# EAGLE schematic V0_24 (EAGLE 8.5.2)
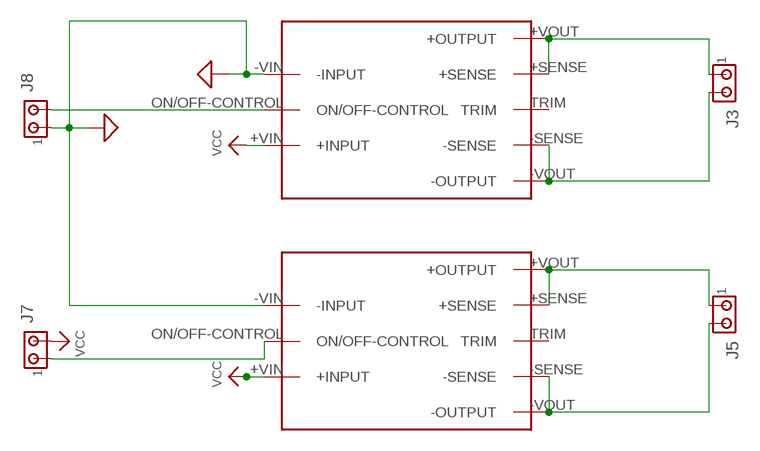
[diagram p0: schematic, sheet 1]

## Parts
J3  MTA02-156  [MYJUMPER]
J5  MTA02-156  [MYJUMPER]
J7  MTA02-156  [MYJUMPER]
J8  MTA02-156  [MYJUMPER]
U$3  DC/DC_CONV_24V  [UWE]
U$4  DC/DC_CONV_24V  [UWE]

## Nets
GND: J8.1 U$3.-VIN(-INPUT) U$4.-VIN(-INPUT) ; supply symbol labelled SUP
N$4: J7.1 U$4.ON/OFF-CONTROL
N$8: J5.1 U$4.+SENSE U$4.+VOUT(+OUTPUT)
N$9: J5.2 U$4.-SENSE U$4.-VOUT(-OUTPUT)
N$13: J3.1 U$3.+SENSE U$3.+VOUT(+OUTPUT)
N$14: J3.2 U$3.-SENSE U$3.-VOUT(-OUTPUT)
N$16: J8.2 U$3.ON/OFF-CONTROL
VCC: J7.2 U$3.+VIN(+INPUT) U$4.+VIN(+INPUT)
Unconnected: U$3.TRIM U$4.TRIM

## Library data of the parts
J3 J5 J7 J8 = 1x2mta:MTA02-156: AMP connector
U$3 U$4 = launch-tower:DC/DC_CONV_24V